# EAGLE schematic helmholtz-distribution-pcb (EAGLE 9.5.1)
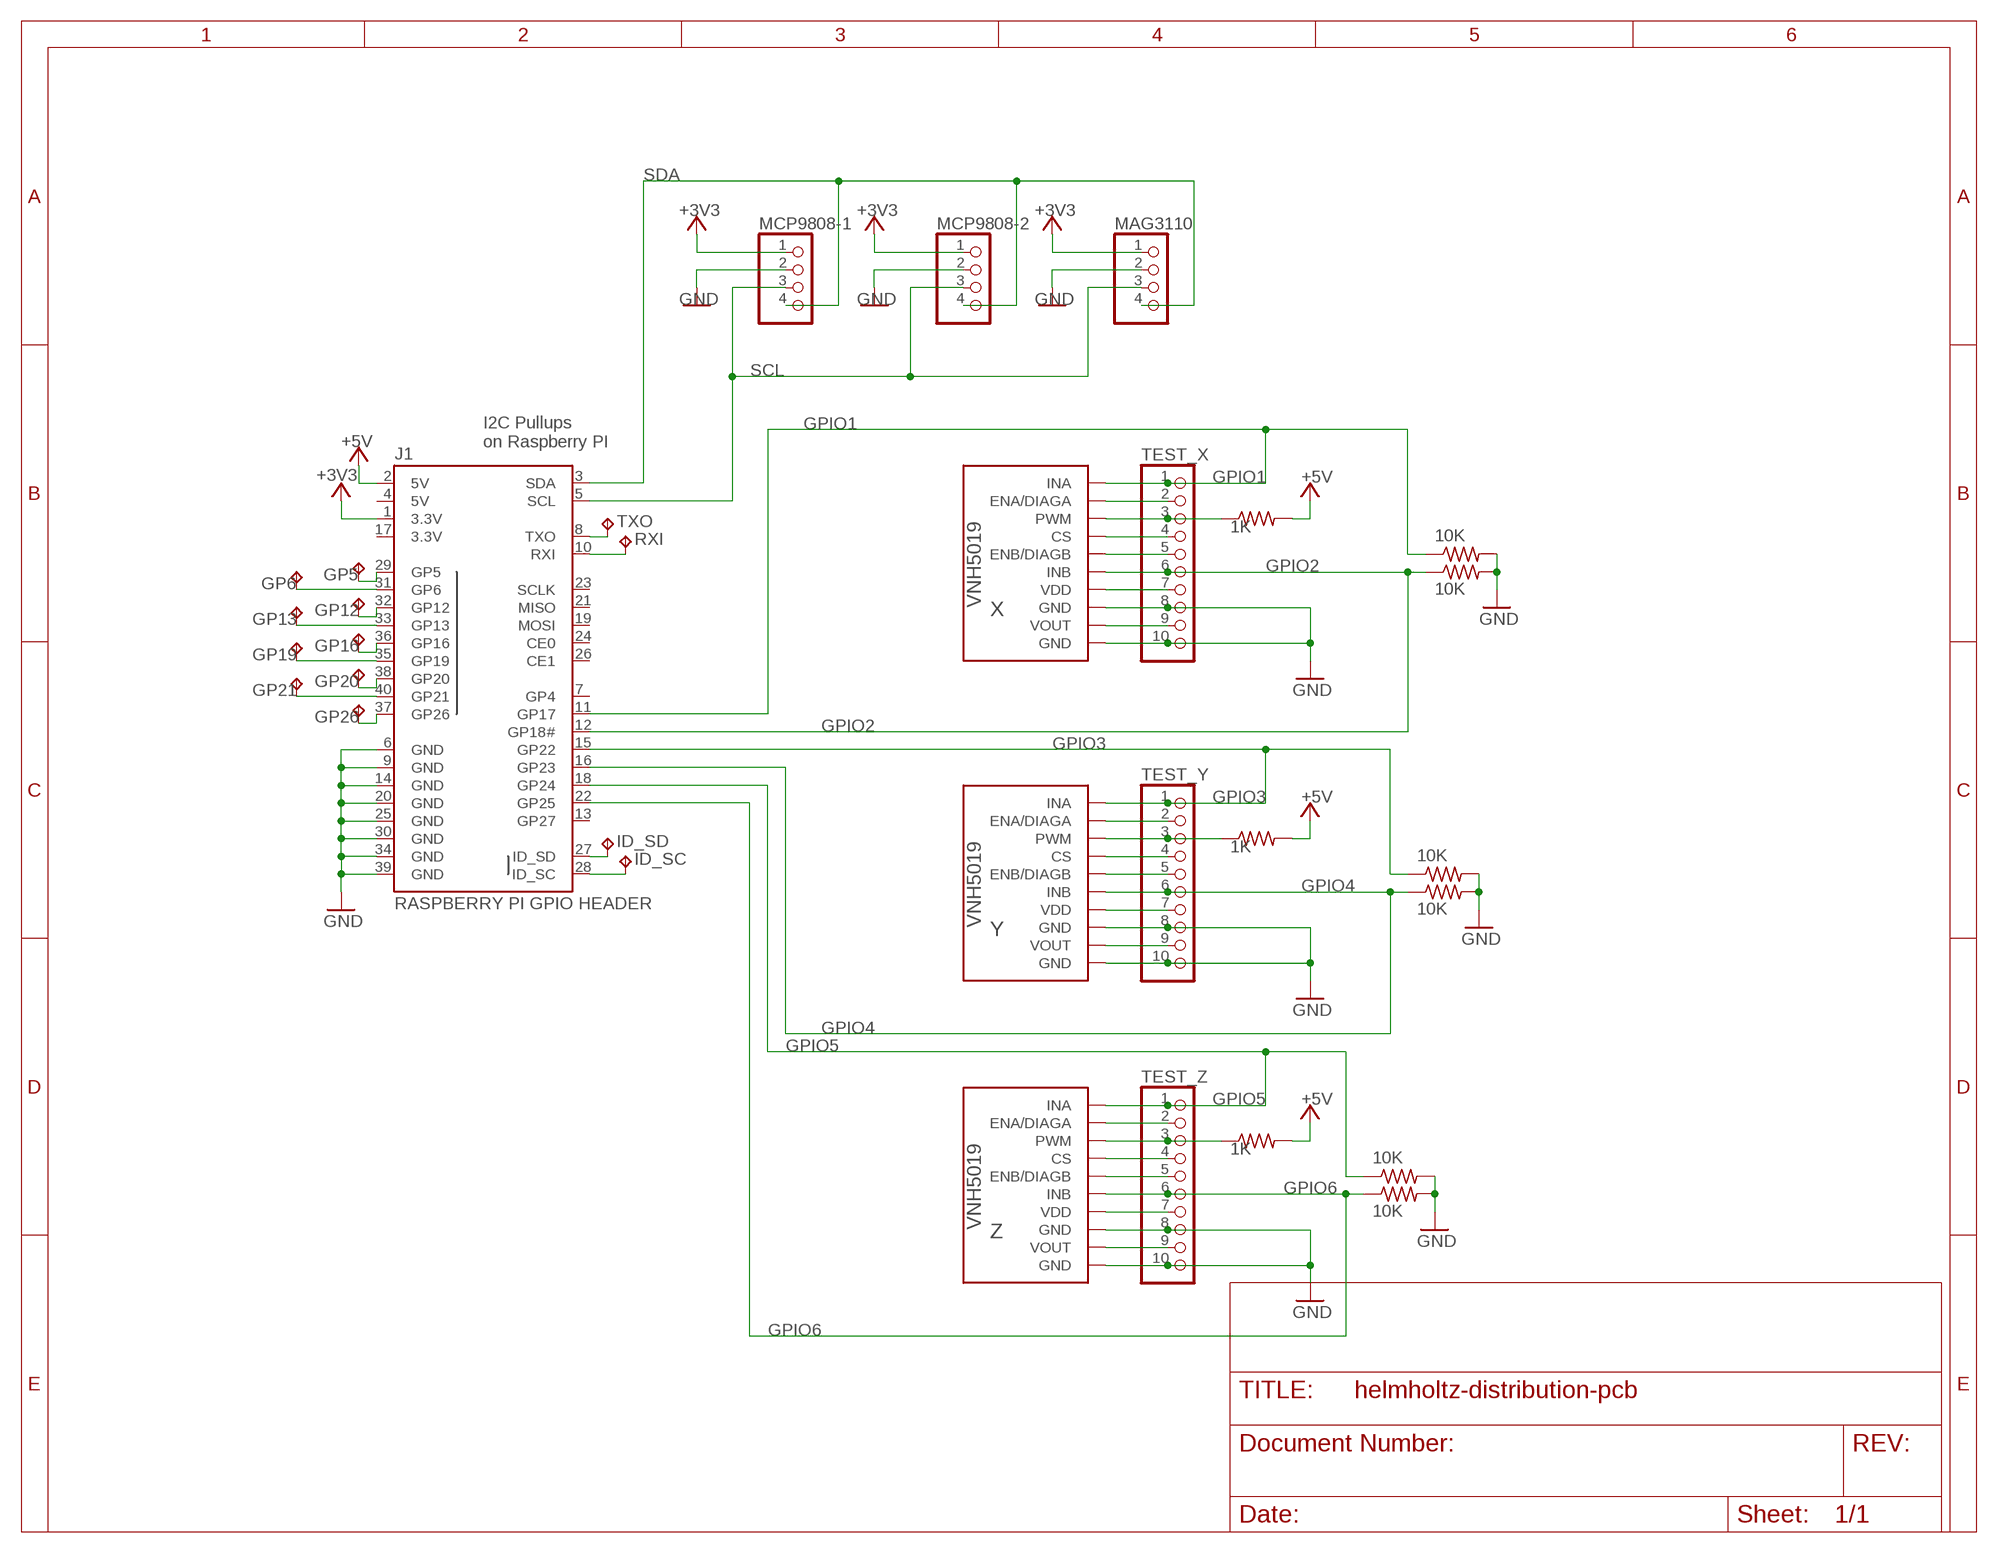
[diagram p0: schematic, sheet 1]

## Parts
GP5  TPPAD1-13  [P1-13]
GP6  TPPAD1-13  [P1-13]
GP12  TPPAD1-13  [P1-13]
GP13  TPPAD1-13  [P1-13]
GP16  TPPAD1-13  [P1-13]
GP19  TPPAD1-13  [P1-13]
GP20  TPPAD1-13  [P1-13]
GP21  TPPAD1-13  [P1-13]
GP26  TPPAD1-13  [P1-13]
ID_SC  TPPAD1-13  [P1-13]
ID_SD  TPPAD1-13  [P1-13]
J1  RASPBERRYPI-40-PIN-GPIO_PTH  [2X20_SHROUDED]
MAG3110  PINHD-1X4  [1X04]
MCP9808-1  PINHD-1X4  [1X04]
MCP9808-2  PINHD-1X4  [1X04]
R2  10K  R-US_R0603  [R0603]
R3  10K  R-US_R0603  [R0603]
R7  1K  R-US_R0603  [R0603]
R9  10K  R-US_R0603  [R0603]
R10  10K  R-US_R0603  [R0603]
R13  1K  R-US_R0603  [R0603]
R16  10K  R-US_R0603  [R0603]
R17  10K  R-US_R0603  [R0603]
R20  1K  R-US_R0603  [R0603]
RXI  TPPAD1-13  [P1-13]
TEST_X  PINHD-1X10  [1X10]
TEST_Y  PINHD-1X10  [1X10]
TEST_Z  PINHD-1X10  [1X10]
TXO  TPPAD1-13  [P1-13]
X  VNH5019  [VNH5019]
Y  VNH5019  [VNH5019]
Z  VNH5019  [VNH5019]

## Nets
+3V3: J1.1(3.3V) MAG3110.1 MCP9808-1.1 MCP9808-2.1
+5V: J1.2(5V) R7.2 R13.2 R20.2
CS_X: TEST_X.4 X.CS
CS_Y: TEST_Y.4 Y.CS
CS_Z: TEST_Z.4 Z.CS
ENA/DIAGA_X: TEST_X.2 X.ENA/DIAGA
ENA/DIAGA_Y: TEST_Y.2 Y.ENA/DIAGA
ENA/DIAGA_Z: TEST_Z.2 Z.ENA/DIAGA
ENB/DIAGB_X: TEST_X.5 X.EBN/DIAGB(ENB/DIAGB)
ENB/DIAGB_Y: TEST_Y.5 Y.EBN/DIAGB(ENB/DIAGB)
ENB/DIAGB_Z: TEST_Z.5 Z.EBN/DIAGB(ENB/DIAGB)
GND: J1.6(GND) J1.9(GND) J1.14(GND) J1.20(GND) J1.25(GND) J1.30(GND) J1.34(GND) J1.39(GND) MAG3110.2 MCP9808-1.2 MCP9808-2.2 R2.2 R3.2 R9.2 R10.2 R16.2 R17.2 TEST_X.8 TEST_X.10 TEST_Y.8 TEST_Y.10 TEST_Z.8 TEST_Z.10 X.GND@1(GND) X.GND@2(GND) Y.GND@1(GND) Y.GND@2(GND) Z.GND@1(GND) Z.GND@2(GND)
GPIO1: J1.11(GP17) R17.1 TEST_X.1 X.INA
GPIO2: J1.12(GP18#) R16.1 TEST_X.6 X.INB
GPIO3: J1.15(GP22) R10.1 TEST_Y.1 Y.INA
GPIO4: J1.16(GP23) R9.1 TEST_Y.6 Y.INB
GPIO5: J1.18(GP24) R3.1 TEST_Z.1 Z.INA
GPIO6: J1.22(GP25) R2.1 TEST_Z.6 Z.INB
N$1: GP26.TP J1.37(GP26)
N$2: GP21.TP J1.40(GP21)
N$3: GP20.TP J1.38(GP20)
N$4: GP19.TP J1.35(GP19)
N$5: GP16.TP J1.36(GP16)
N$6: GP13.TP J1.33(GP13)
N$7: GP12.TP J1.32(GP12)
N$8: GP6.TP J1.31(GP6)
N$9: GP5.TP J1.29(GP5)
N$10: J1.8(TXO) TXO.TP
N$11: J1.10(RXI) RXI.TP
N$12: ID_SD.TP J1.27(ID_SD)
N$13: ID_SC.TP J1.28(ID_SC)
PWM_X: R20.1 TEST_X.3 X.PWM
PWM_Y: R13.1 TEST_Y.3 Y.PWM
PWM_Z: R7.1 TEST_Z.3 Z.PWM
SCL: J1.5(SCL) MAG3110.3 MCP9808-1.3 MCP9808-2.3
SDA: J1.3(SDA) MAG3110.4 MCP9808-1.4 MCP9808-2.4
VDD_X: TEST_X.7 X.VDD
VDD_Y: TEST_Y.7 Y.VDD
VDD_Z: TEST_Z.7 Z.VDD
VOUT_X: TEST_X.9 X.VOUT
VOUT_Y: TEST_Y.9 Y.VOUT
VOUT_Z: TEST_Z.9 Z.VOUT
Unconnected: J1.7(GP4) J1.13(GP27) J1.19(MOSI) J1.21(MISO) J1.23(SCLK) J1.24(CE0) J1.26(CE1)

## Notes on the sheet
- I2C Pullups 
  on Raspberry PI
- X
- RASPBERRY PI GPIO HEADER
- Y
- Z

## Power pins joined to a net without a drawn wire
3.3V: J1.17(3.3V)
5V: J1.4(5V)

## Library data of the parts
GP5 GP6 GP12 GP13 GP16 GP19-GP21 GP26 ID_SC ID_SD RXI TXO = testpad:TP: Test pad
J1 = SparkFun-Connectors:RASPBERRYPI-40-PIN-GPIO: Raspberry Pi GPIO Header 2x20 pin connector, as found on B, B+, A+ models. Both shrouded PTH and SMT versions available. SparkFun Products: GPIO Shrouded Header <https://www.sparkfun.com/products/13054>- PTH SparkFun Pi Wedge (Preassembled) <https://www.sparkfun.com/products/13717>; PROD_ID: CONN-12263; SF_ID: PRT-13054
MAG3110 MCP9808-1 MCP9808-2 = pinhead:PINHD-1X4: PIN HEADER
R2 R3 R7 R9 R10 R13 R16 R17 R20 = rcl:R-US_: RESISTOR, American symbol; SPICEPREFIX: R
TEST_X TEST_Y TEST_Z = pinhead:PINHD-1X10: PIN HEADER
X Y Z = HelmholtzCage:VNH5019